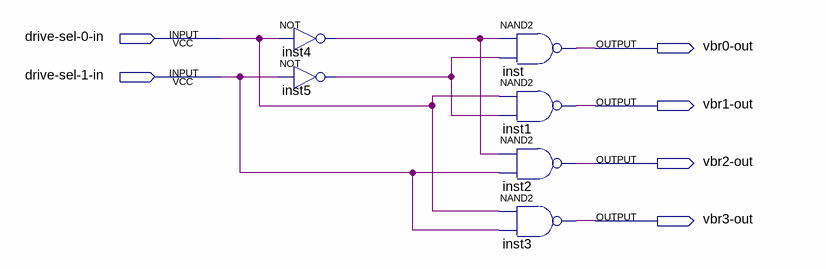
[diagram p0: schematic sheet]
// Quartus schematic drive_select_decoder.bdf as structural Verilog: 6 symbols, 6 pins
module drive_select_decoder (
  input  \drive-sel-0-in ,
  input  \drive-sel-1-in ,
  output \vbr0-out ,
  output \vbr1-out ,
  output \vbr2-out ,
  output \vbr3-out 
);

  wire inst4_out, inst5_out;

  not inst4 (inst4_out, \drive-sel-0-in );
  not inst5 (inst5_out, \drive-sel-1-in );
  nand inst (\vbr0-out , inst4_out, inst5_out);
  nand inst1 (\vbr1-out , \drive-sel-0-in , inst5_out);
  nand inst2 (\vbr2-out , inst4_out, \drive-sel-1-in );
  nand inst3 (\vbr3-out , \drive-sel-0-in , \drive-sel-1-in );
endmodule
